# EAGLE schematic v1 (EAGLE 9.6.2)
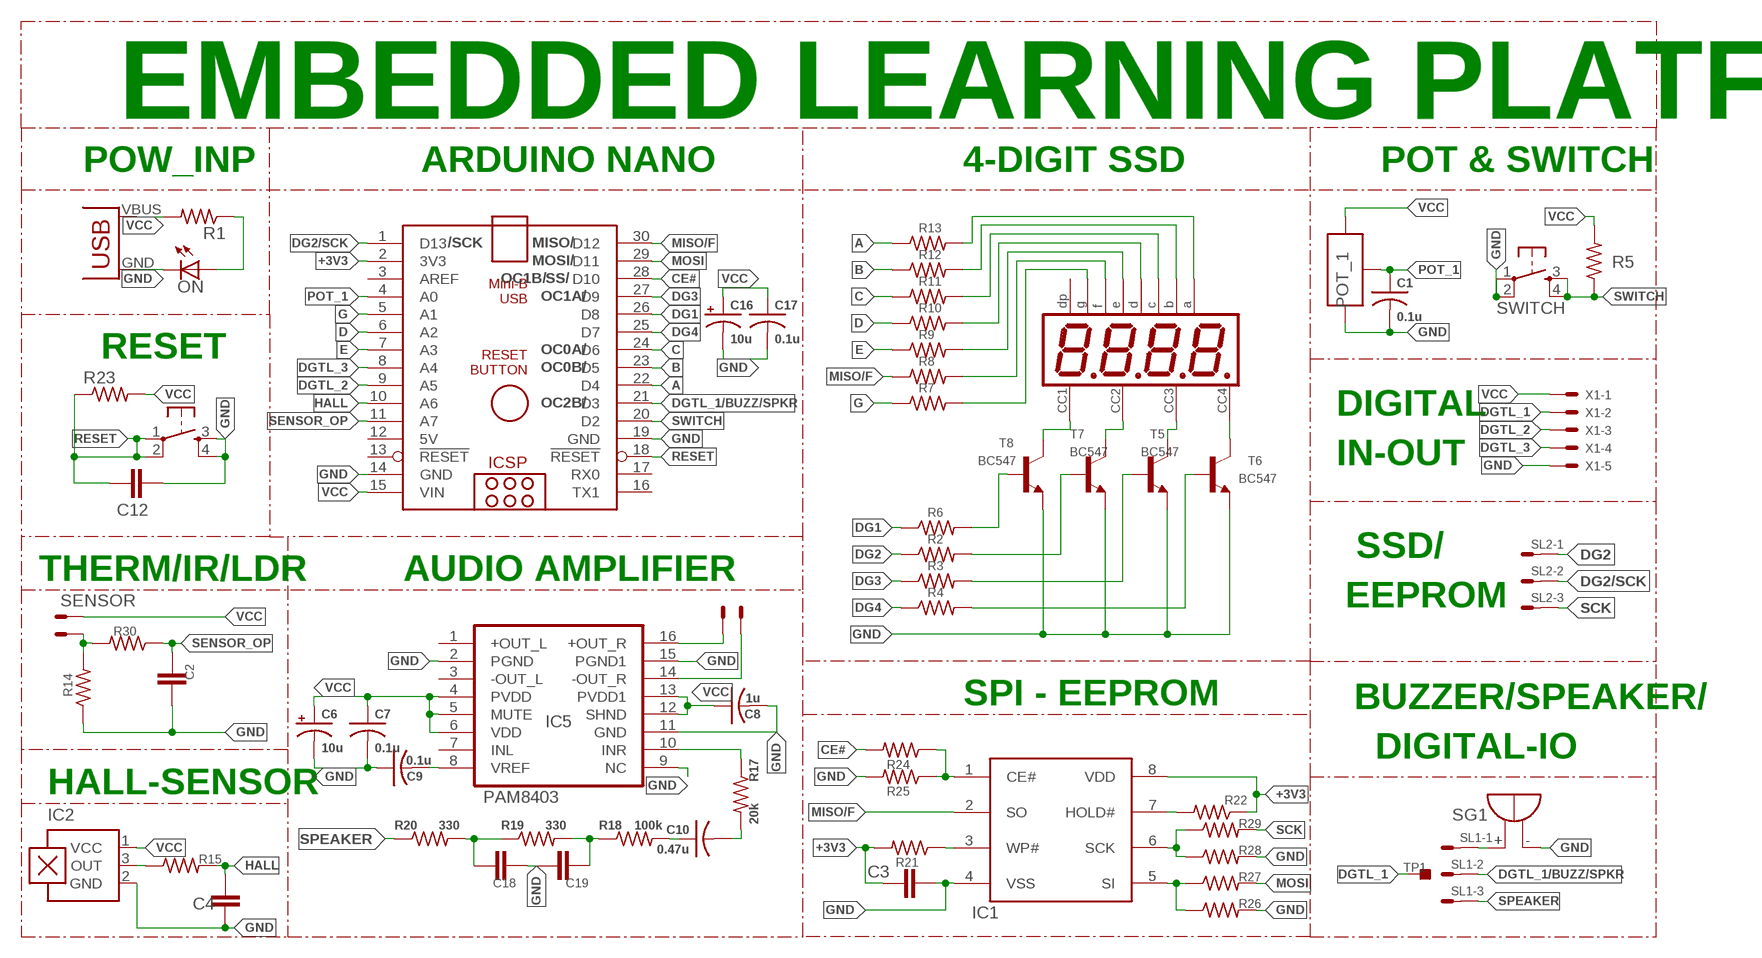
[diagram p0: schematic, sheet 1]

## Parts
ARDUINO_NANO1  ARDUINO_NANO  [ARDUINO_NANO]
C1  0.1u  CAP0603  [C0603]
C2  0.1u  C-EUC0805  [C0805]
C3  0.1u  C-EUC0805  [C0805]
C4  0.1u  C-EUC0805  [C0805]
C6  10u  CAP_POL_16V  [B/3528-21R]
C7  0.1u  CAP0603  [C0603]
C8  1u  CAP0603  [C0603]
C9  0.1u  CAP0603  [C0603]
C10  0.47u  CAP0603  [C0603]
C12  0.1u  C-EUC0805  [C0805]
C16  10u  CAP_POL_16V  [B/3528-21R]
C17  0.1u  CAP0603  [C0603]
C18  0.1u  C-EUC0805  [C0805]
C19  0.1uf  C-EUC0805  [C0805]
DIS1  NFD-5641AS-ALT  [NFD-5641]
IC1  SST25VF040B_SPI_FLASH  [SOIC08]
IC2  HALL SENSOR  A1301UA  [SIP3-UA]
IC5  PAM8403  [SOP-16]
ON  LED3MM  [LED3MM]
POT_1  POTNORMAL  [RJ9W]
R1  R-US_0204/7  [0204/7]
R2  R-US_0204/7  [0204/7]
R3  R-US_0204/7  [0204/7]
R4  R-US_0204/7  [0204/7]
R5  R-US_0204/7  [0204/7]
R6  R-US_0204/7  [0204/7]
R7  R-US_0204/7  [0204/7]
R8  R-US_0204/7  [0204/7]
R9  R-US_0204/7  [0204/7]
R10  R-US_0204/7  [0204/7]
R11  R-US_0204/7  [0204/7]
R12  R-US_0204/7  [0204/7]
R13  R-US_0204/7  [0204/7]
R14  R-US_0204/7  [0204/7]
R15  R-US_0204/7  [0204/7]
R17  20k  R-US_M0805  [M0805]
R18  100k  R-US_M0805  [M0805]
R19  330  R-US_M0805  [M0805]
R20  330  R-US_M0805  [M0805]
R21  R-US_0204/7  [0204/7]
R22  R-US_0204/7  [0204/7]
R23  R-US_0204/7  [0204/7]
R24  R-US_0204/7  [0204/7]
R25  R-US_0204/7  [0204/7]
R26  R-US_0204/7  [0204/7]
R27  R-US_0204/7  [0204/7]
R28  R-US_0204/7  [0204/7]
R29  R-US_0204/7  [0204/7]
R30  R-US_0204/7  [0204/7]
RESET  10xx  OMRON_SWITCH_10-XX  [B3F-10XX]
SG1  BUZZER  [F/TMB]
SL1  M03S  [03P]
SL2  M03S  [03P]
SPEAKER  SPEAKER  JST-XH-02-PIN-LONG-PAD  [JST-XH-02-PACKAGE-LONG-PAD]
SWITCH  OMRON_SWITCH_40-XX  [B3F-40XX]
T5  BC547  [TO92]
T6  BC547  [TO92]
T7  BC547  [TO92]
T8  BC547  [TO92]
TP1  TESTPOINT_TPS-PAD-036  [TESTPOINT_PAD-036]
U$2  USB(POWER)  [USB(POWER)]
X1  JST-XH-05-PIN-LONG-PAD  [JST-XH-05-PACKAGE-LONG-PAD]
X2  SENSOR  JST-XH-02-PIN-LONG-PAD  [JST-XH-02-PACKAGE-LONG-PAD]

## Nets
+3V3: ARDUINO_NANO1.2(3V3) C3.1 IC1.8(VDD) R21.2 R22.1
A: ARDUINO_NANO1.22(D4) R13.1
B: ARDUINO_NANO1.23(D5) R12.1
BUZZER: SG1.+ SL1.1
C: ARDUINO_NANO1.24(D6) R11.1
CE#: ARDUINO_NANO1.28(D10) R24.2
D: ARDUINO_NANO1.6(A2) R10.1
DG1: ARDUINO_NANO1.26(D8) R6.1
DG2: R2.1 SL2.1
DG2/SCK: ARDUINO_NANO1.1(D13) SL2.2
DG3: ARDUINO_NANO1.27(D9) R3.1
DG4: ARDUINO_NANO1.25(D7) R4.1
DGTL_1: TP1.1(TP) X1.2
DGTL_1/BUZZ/SPKR: ARDUINO_NANO1.21(D3) SL1.2
DGTL_2: ARDUINO_NANO1.9(A5) X1.3
DGTL_3: ARDUINO_NANO1.8(A4) X1.4
E: ARDUINO_NANO1.7(A3) R9.1
G: ARDUINO_NANO1.5(A1) R7.1
GND: ARDUINO_NANO1.14(GND) ARDUINO_NANO1.19(GND) C1.2 C2.1 C3.2 C4.1 C6.- C7.2 C8.2 C9.1 C12.2 C16.- C17.2 C18.2 C19.2 IC1.4(VSS) IC2.2(GND) IC5.2(PGND) IC5.9(NC) IC5.11(GND) IC5.15(PGND1) ON.K(C) POT_1.E R14.1 R25.2 R26.2 R28.2 RESET.3(S) RESET.4(S1) SG1.- SWITCH.1(P) SWITCH.2(P1) T5.1(E) T6.1(E) T7.1(E) T8.1(E) U$2.GND X1.5
HALL: ARDUINO_NANO1.10(A6) C4.2 R15.2
MICIN1: C19.1 R18.1 R19.2
MISO/F: ARDUINO_NANO1.30(D12) IC1.2(SO) R8.1
MOSI: ARDUINO_NANO1.29(D11) R27.2
N$1: ON.A R1.1
N$2: DIS1.P$12 T8.3(C)
N$3: DIS1.P$6 T6.3(C)
N$4: DIS1.P$8 T5.3(C)
N$5: DIS1.P$9 T7.3(C)
N$6: R6.2 T8.2(B)
N$7: R2.2 T7.2(B)
N$8: R3.2 T5.2(B)
N$9: R4.2 T6.2(B)
N$10: IC2.3(OUT) R15.1
N$11: DIS1.P$5 R7.2
N$12: DIS1.P$10 R8.2
N$13: DIS1.P$1 R9.2
N$14: DIS1.P$2 R10.2
N$15: DIS1.P$4 R11.2
N$16: DIS1.P$7 R12.2
N$17: DIS1.P$11 R13.2
N$18: IC5.16(+OUT_R) SPEAKER.1
N$19: IC5.14(-OUT_R) SPEAKER.2
N$20: C9.2 IC5.8(VREF)
N$21: C10.2 R17.2
N$22: IC1.7(HOLD#) R22.2
N$23: IC1.3(WP#) R21.1
N$24: IC1.1(CE#) R24.1 R25.1
N$25: IC1.5(SI) R26.1 R27.1
N$27: IC1.6(SCK) R28.1 R29.1
N$29: IC5.10(INR) R17.1
N$35: C18.1 R19.1 R20.2
N$37: C10.1 R18.2
POT_1: ARDUINO_NANO1.4(A0) C1.1 POT_1.S
RESET: ARDUINO_NANO1.18(!RESET) C12.1 R23.1 RESET.1(P) RESET.2(P1)
SCK: R29.2 SL2.3
SENSOR_OP: ARDUINO_NANO1.11(A7) C2.2 R14.2 R30.1 R30.2 X2.1
SPEAKER: R20.1 SL1.3
SWITCH: ARDUINO_NANO1.20(D2) R5.1 SWITCH.3(S) SWITCH.4(S1)
VCC: ARDUINO_NANO1.15(VIN) C6.+ C7.1 C8.1 C16.+ C17.1 IC2.1(VCC) IC5.4(PVDD) IC5.5(MUTE) IC5.6(VDD) IC5.12(SHND) IC5.13(PVDD1) POT_1.A R1.2 R5.2 R23.2 U$2.VBUS(VCC) X1.1 X2.2
Unconnected: ARDUINO_NANO1.3(AREF) ARDUINO_NANO1.13(!RESET) ARDUINO_NANO1.16(TX1) ARDUINO_NANO1.17(RX0) DIS1.P$3 IC5.1(+OUT_L) IC5.3(-OUT_L) IC5.7(INL)

## Notes on the sheet
- EMBEDDED LEARNING PLATFORM
- POW_INP | ARDUINO NANO | 4-DIGIT SSD | POT & SWITCH
- /SCK | MISO/
- MOSI/
- OC1B/ | SS/
- OC1A/
- OC0A/
- RESET
- OC0B/
- OC2B/
- DIGITAL
  IN-OUT
- THERM/IR/LDR | AUDIO AMPLIFIER
- SSD/
  EEPROM
- SPI - EEPROM
- BUZZER/SPEAKER/
    DIGITAL-IO
- HALL-SENSOR

## Power pins joined to a net without a drawn wire
5V: ARDUINO_NANO1.12(5V)

## Library data of the parts
ARDUINO_NANO1 = ArduinoNanoV30:ARDUINO_NANO: Arduino Nano V3.0 Overview: The Arduino Nano is a small, complete, and breadboard-friendly board based on the ATmega328 (Arduino Nano 3.x) or ATmega168 (Arduino Nano 2.x). It has more or less the same functionality of the Arduino Duemilanove, but in a different package. It lacks only a DC power jack, and works with a Mini-B USB cable instead of a standard one. The Nano was designed and is being produced by Gravitech. Specifications: Microcontroller Atmel ATmega168 or ATmega328 Operating Voltage (logic level) 5 V Input Voltage (recommended) 7-12 V Input Voltage (limits) 6-20 V Digital I/O Pins 14 (of which 6 provide PWM output) Analog Input Pins 8 DC Current per I/O Pin 40 mA Flash Memory 16 KB (ATmega168) or 32 KB (ATmega328) of which 2 KB used by bootloader SRAM 1 KB (ATmega168) or 2 KB (ATmega328) EEPROM 512 bytes (ATmega168) or 1 KB (ATmega328) Clock Speed 16 MHz Dimensions 0.73" x 1.70" Length 45 mm Width 18 mm Weigth 5 g Power: The Arduino Nano can be powered via the Mini-B USB connection, 6-20V unregulated external power supply (pin 30), or 5V regulated external power supply (pin 27). The power source is automatically selected to the highest voltage source. Memory: The ATmega168 has 16 KB of flash memory for storing code (of which 2 KB is used for the bootloader); the ATmega328 has 32 KB, (also with 2 KB used for the bootloader). The ATmega168 has 1 KB of SRAM and 512 bytes of EEPROM (which can be read and written with the EEPROM library); the ATmega328 has 2 KB of SRAM and 1 KB of EEPROM. Input and Output: Each of the 14 digital pins on the Nano can be used as an input or output, using pinMode(), digitalWrite(), and digitalRead() functions. They operate at 5 volts. Each pin can provide or receive a maximum of 40 mA and has an internal pull-up resistor (disconnected by default) of 20-50 kOhms. In addition, some pins have specialized functions. Visit Arduino - ArduinoBoardNano <https://www.arduino.cc/en/Main/ArduinoBoardNano>
C1 C7-C10 C17 = CEDT_JANUARY_2015_v5:CAP
C2 C18 C19 = Arduino_Hackathon_v5:C-EU: CAPACITOR, European symbol
C3 C4 C12 = rcl:C-EU: CAPACITOR, European symbol
C6 C16 = CEDT_JANUARY_2015_v5:CAP_POL
DIS1 = display-nfd:NFD-5641AS-ALT: Four Digit 0.56" CC Seven-Segment LED Display Futurlec part number: 7FR5641AS Created by RobG
IC1 = CEDT_JANUARY_2015_v5:SST25VF040B_SPI_FLASH
IC2 = allegro:A13*?: Linear Hall Effect Sensor ICs Continuous-Time Ratiometric High-Temperature Operation Programmable Linear with Analog Output A1302 -Replacement- UGN3503 Source: http://www.allegromicro.com/en/Products/Part_Numbers/1301/1301.pdf http://www.allegromicro.com/en/Products/Part_Numbers/1321/1321.pdf http://www.allegromicro.com/en/Products/Part_Numbers/1381/1381.pdf; MF: ALLEGRO MICROSYSTEMS, INC.; MPN: A1301EUA-T; OC_FARNELL: 1198085; OC_NEWARK: 31K6635
IC5 = PAM8403:PAM8403: Dual channel audio amplifier IC - PAM8403
ON = CEDT:LED; OC_FARNELL: unknown
POT_1 = CEDT_JANUARY_2015_v5:POT
R1-R15 R17-R22 R24-R30 = rcl:R-US_: RESISTOR, American symbol; SPICEPREFIX: R
R23 = resistor:R-US_: RESISTOR, American symbol
RESET SWITCH = CEDT_JANUARY_2015_v5:OMRON_SWITCH
SG1 = CEDT_JANUARY_2015_v5:BUZZER: BUZZER Source: Buerklin; OC_FARNELL: unknown; OC_NEWARK: unknown
SL1 SL2 = con-amp-quick:M03S: AMP QUICK CONNECTOR; OC_FARNELL: unknown; OC_NEWARK: unknown
SPEAKER X2 = Rembrandt Electronics - JST XH Connectors v1-0:JST-XH-02-PIN: JST XH Connector 2 Pin Wire to board connector. Pitch: 2,54 mm, (0.100") Number of pins: 2 Created by Rembrandt Electronics www.rembrandtelectronics.com
T5-T8 = chess timer:BC547: NPN TRANSISTOR
TP1 = 52101-101-REV-A_v16:TESTPOINT_TPS: TEST POINT PAD; BOM: EXCLUDE
U$2 = CEDT_JANUARY_2015_v5:USB(POWER)
X1 = Rembrandt Electronics - JST XH Connectors v1-0:JST-XH-05-PIN: JST XH Connector 2 Pin Wire to board connector. Pitch: 2,54 mm, (0.100") Number of pins: 5 Created by Rembrandt Electronics www.rembrandtelectronics.com

## Net classes
0 default: width 0.406 mm
1 POWER: width 0.61 mm, drill 0.7 mm, clearance 0.25 mm